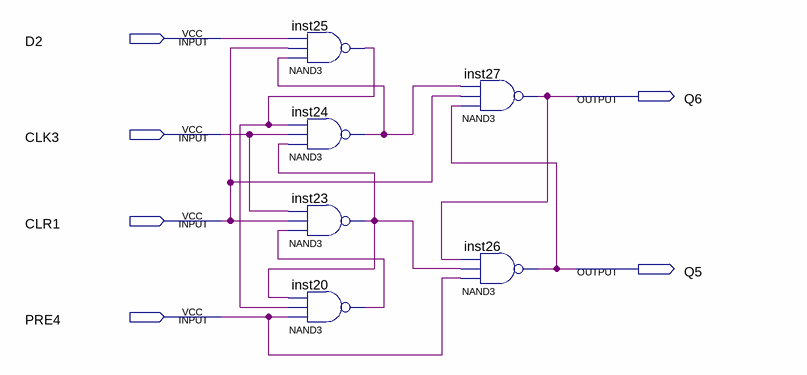
[diagram p0: schematic sheet]
// Quartus schematic 74LS74a_1.bdf as structural Verilog: 6 symbols, 6 pins
module \74LS74a_1  (
  input  D2,
  input  CLK3,
  input  CLR1,
  input  PRE4,
  output Q6,
  output Q5
);

  wire inst20_out, inst23_out, inst24_out, inst25_out;

  nand inst25 (inst25_out, inst24_out, CLR1, D2);
  nand inst24 (inst24_out, inst23_out, CLK3, inst25_out);
  nand inst23 (inst23_out, inst20_out, CLR1, CLK3);
  nand inst20 (inst20_out, PRE4, inst25_out, inst23_out);
  nand inst27 (Q6, Q5, CLR1, inst24_out);
  nand inst26 (Q5, PRE4, inst23_out, Q6);
endmodule
